# Altium schematic sheet GSMGPSMC60.SchDoc
size A2
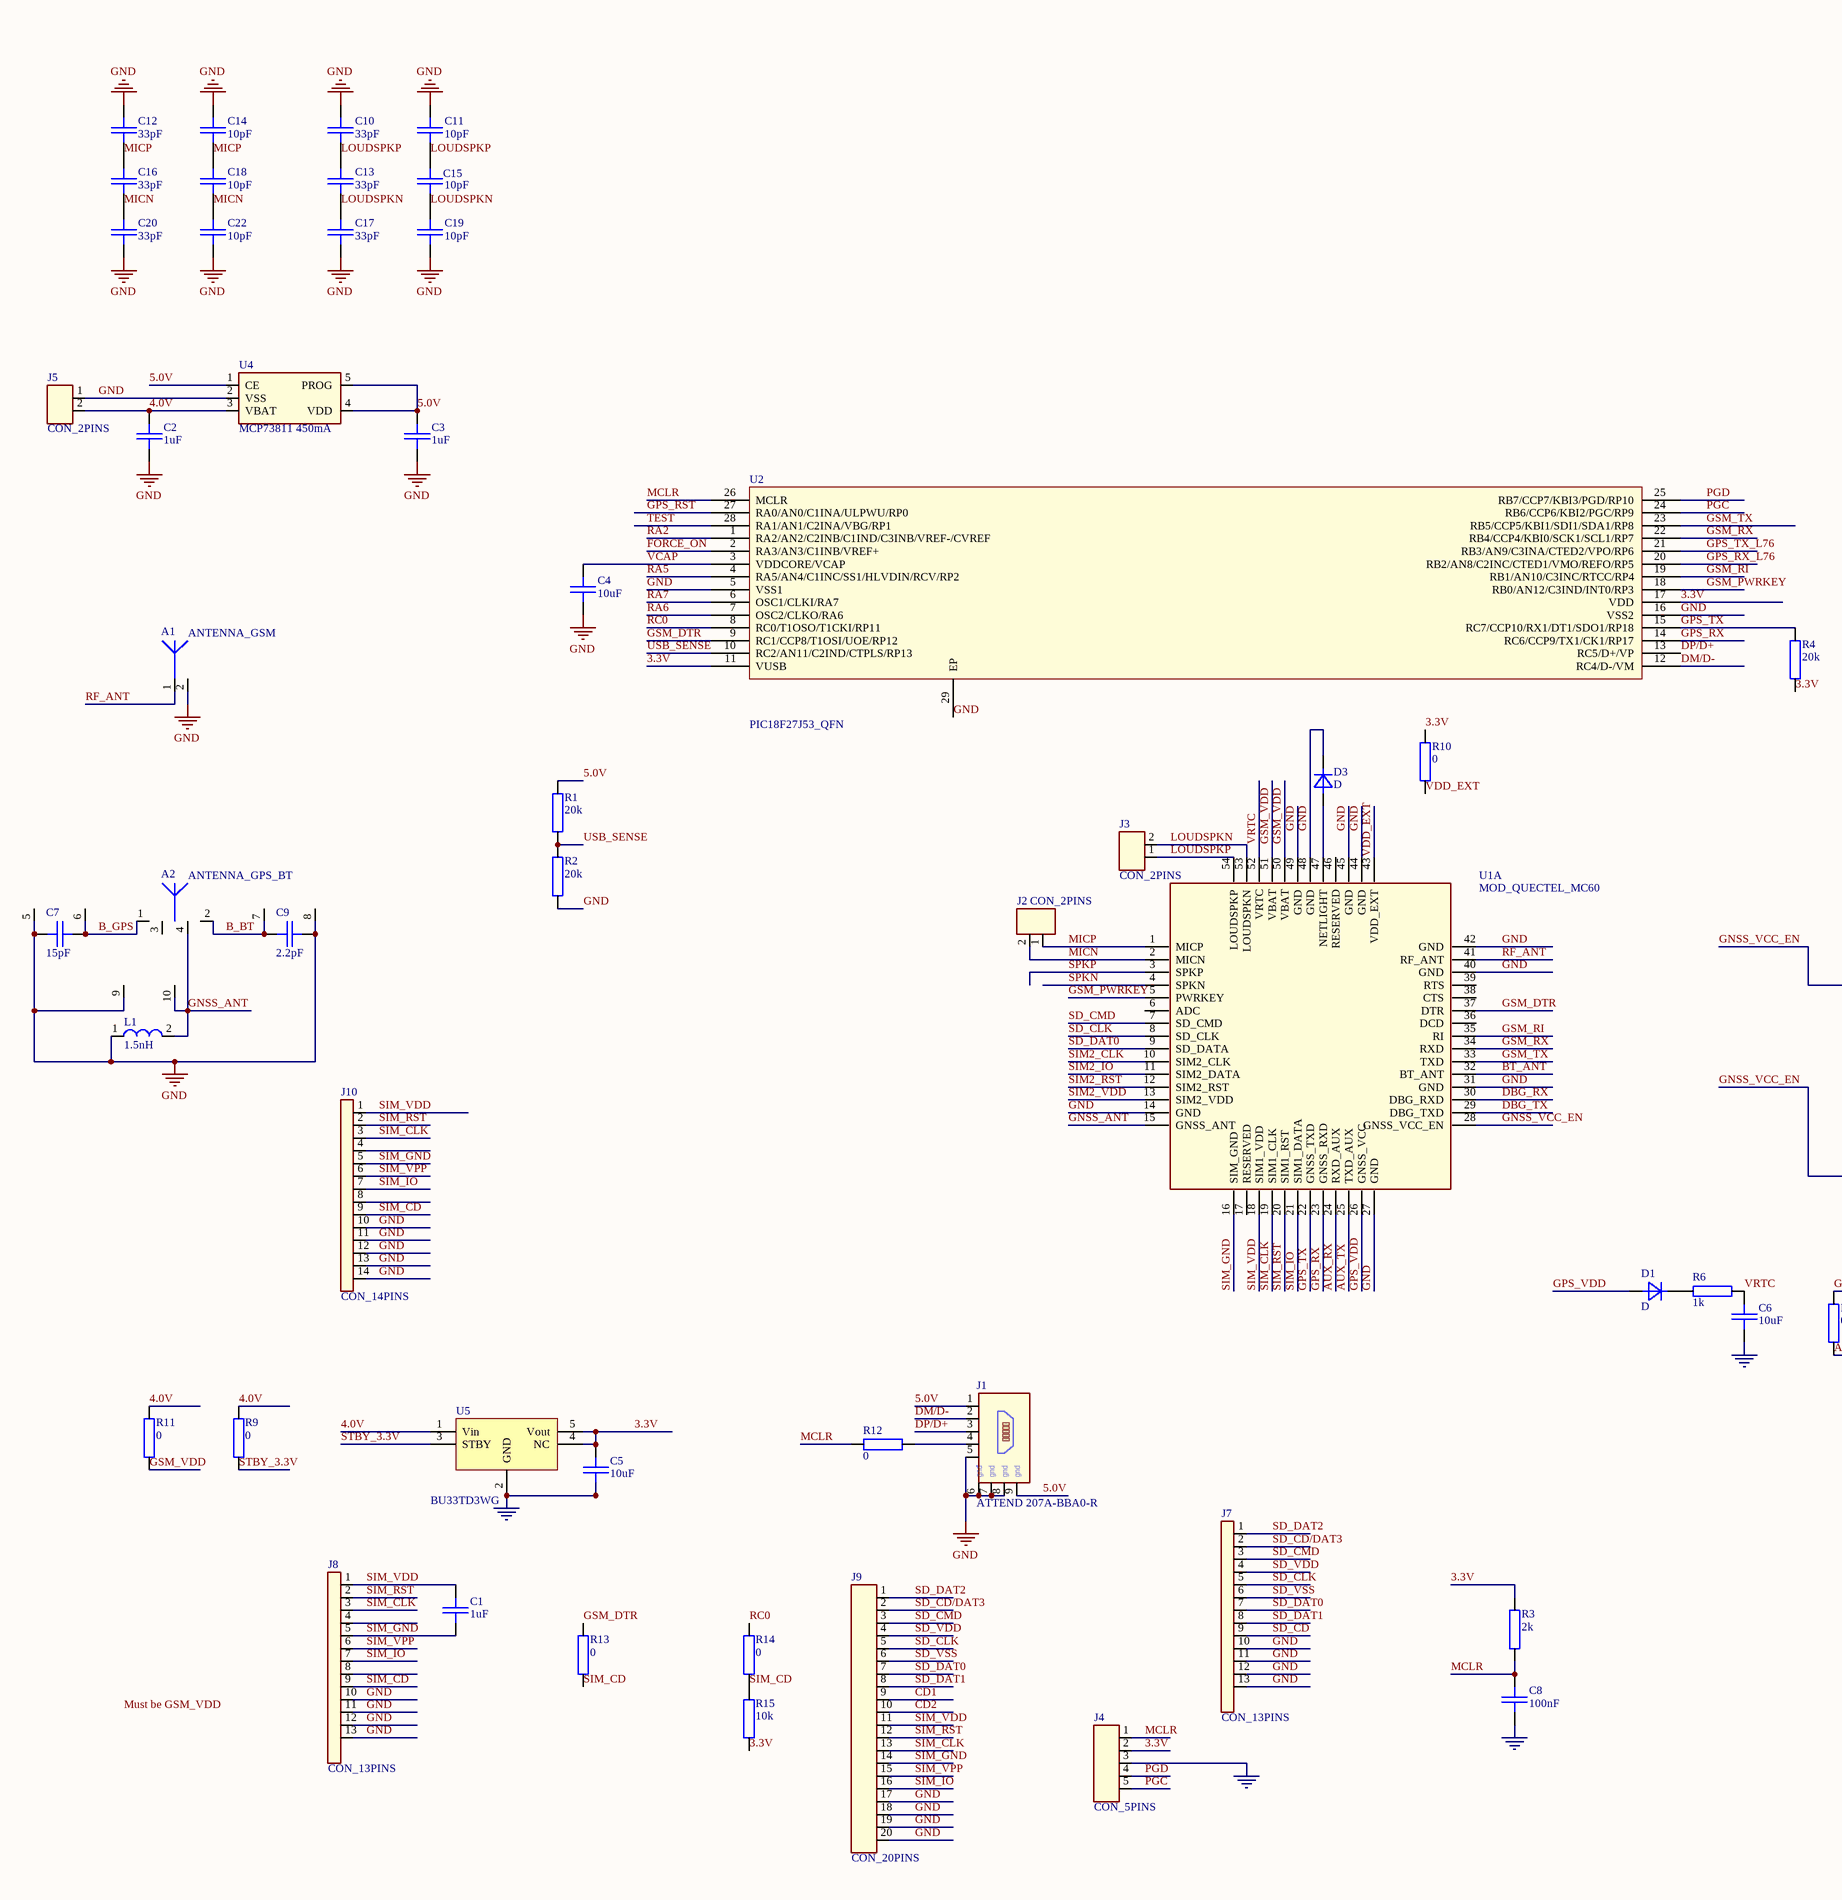
[diagram p0: GSMGPSMC60.SchDoc, left]
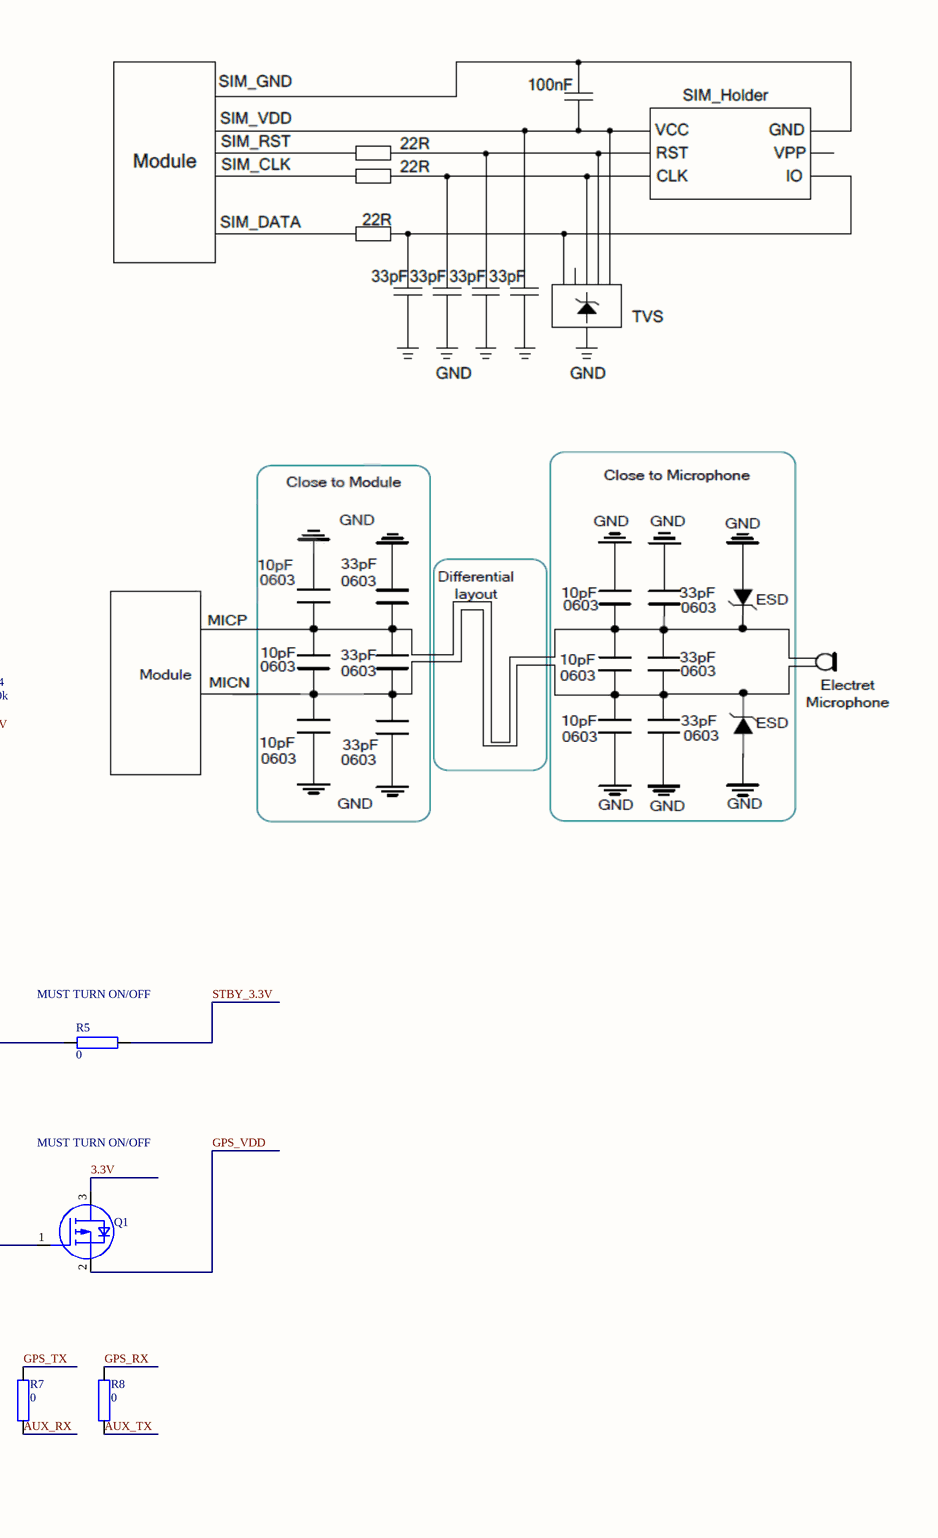
[diagram p1: GSMGPSMC60.SchDoc, right]

## Parts
A1  ANTENNA_GSM  [SMD_CON_ANTENNA_GSM]
A2  ANTENNA_GPS_BT  [SMD_CHIP_ANTENNA_GPS_BT - FLIP]
C1  1uF  [SMD_0603_CAPC1608X95N]
C2  1uF  [SMD_0603_CAPC1608X95N]
C3  1uF  [SMD_0603_CAPC1608X95N]
C4  10uF  [SMD_0603_CAPC1608X95N]
C5  10uF  [SMD_0603_CAPC1608X95N]
C6  10uF  [SMD_0603_CAPC1608X95N]
C7  15pF  [SMD_0402_CAPC1005X90N - ANTENNA]
C8  100nF  [SMD_0402_CAPC1005X90N]
C9  2.2pF  [SMD_0201_CAPC0603X33N - ANTENNA]
C10  33pF  [SMD_0402_CAPC1005X90N]
C11  10pF  [SMD_0402_CAPC1005X90N]
C12  33pF  [SMD_0402_CAPC1005X90N]
C13  33pF  [SMD_0402_CAPC1005X90N]
C14  10pF  [SMD_0402_CAPC1005X90N]
C15  10pF  [SMD_0402_CAPC1005X90N]
C16  33pF  [SMD_0402_CAPC1005X90N]
C17  33pF  [SMD_0402_CAPC1005X90N]
C18  10pF  [SMD_0402_CAPC1005X90N]
C19  10pF  [SMD_0402_CAPC1005X90N]
C20  33pF  [SMD_0402_CAPC1005X90N]
C22  10pF  [SMD_0402_CAPC1005X90N]
D1  D  [SMD_SOD523_SOD1608X65N]
D3  D  [SMD_LED_LAA67F]
J1  ATTEND 207A-BBA0-R  [SMD_CON_MICRO_USB]
J2  CON_2PINS  [PTH_MIC_6MM_2.7MM_PITCH1.9]
J3  CON_2PINS  [PTH_MIC_6MM_2.7MM_PITCH1.9]
J4  CON_5PINS  [SIP5 - PGM]
J5  CON_2PINS  [PTH_HDRV02W64P254_1X02]
J7  CON_13PINS  [NONE]
J8  CON_13PINS  [SMD_CON-ATTEND_MICRO_SIM_115Q-BCA0]
J9  CON_20PINS  [NONE]
J10  CON_14PINS  [NONE]
L1  1.5nH  [SMD_0402_INDC1005X55N - ANTENNA]
Q1  BSH202  [SMD_SOT23_SOT95P240X120-3N]  (value not drawn)
R1  20k  [SMD_0402_RESC1005X37N]
R2  20k  [SMD_0402_RESC1005X37N]
R3  2k  [SMD_0402_RESC1005X37N]
R4  20k  [SMD_0402_RESC1005X37N]
R5  0  [SMD_0402_RESC1005X37N]
R6  1k  [SMD_0603_RESC1608X55N]
R7  0  [SMD_0603_RESC1608X55N]
R8  0  [SMD_0603_RESC1608X55N]
R9  0  [SMD_0402_RESC1005X37N]
R10  0  [SMD_0402_RESC1005X37N]
R11  0  [SMD_0402_RESC1005X37N]
R12  0  [SMD_0402_RESC1005X37N]
R13  0  [SMD_0402_RESC1005X37N]
R14  0  [SMD_0402_RESC1005X37N]
R15  10k  [SMD_0402_RESC1005X37N]
U1  MOD_QUECTEL_MC60  [SMD_MOD_MC60]  (part A of 2)
U2  PIC18F27J53_QFN  [SMD_QFN65P600X600X100-29AN]
U4  MCP73811 450mA  [SMD_SOT26_SOT95P285X140-5N - DLV]
U5  BU33TD3WG  [SMD_SOT26_SOT95P285X140-5N - DLV]

## Nets
GND: A1.2 A2.5 A2.8 A2.9 C2.2 C3.2 C4.2 C5.2 C6.2 C7.1 C8.2 C9.2 C10.1 C11.1 C12.1 C14.1 C17.2 C19.2 C20.2 C22.2 D3.1(C) J1.5 J1.6 J1.7 J1.8 J4.3 J5.1 J7.10 J7.11 J7.12 J7.13 J8.10 J8.11 J8.12 J8.13 J9.17 J9.18 J9.19 J9.20 J10.10 J10.11 J10.12 J10.13 J10.14 L1.1 R2.1 U1.14(GND) U1.27(GND) U1.31(GND) U1.40(GND) U1.42(GND) U1.44(GND) U1.45(GND) U1.48(GND) U1.49(GND) U2.5(VSS1) U2.16(VSS2) U2.29(EP) U4.2(VSS) U5.2(GND)
3.3V: C5.1 J4.2 Q1.3(D) R3.1 R4.1 R10.2 R15.2 U2.11(VUSB) U2.17(VDD) U5.4(NC) U5.5(Vout)
4.0V: C2.1 J5.2 R9.1 R11.1 U4.3(VBAT) U5.1(Vin)
5.0V: C3.1 J1.1 J1.9 R1.2 U4.1(CE) U4.4(VDD) U4.5(PROG)
AUX_RX: R7.2 U1.24(RXD_AUX)
AUX_TX: R8.1 U1.25(TXD_AUX)
B_BT: A2.2 A2.7 C9.1
B_GPS: A2.1 A2.6 C7.2
BT_ANT: U1.32(BT_ANT)
CD1: J9.9
CD2: J9.10
DBG_RX: U1.30(DBG_RXD)
DBG_TX: U1.29(DBG_TXD)
DM/D-: J1.2 U2.12(RC4/D-/VM)
DP/D+: J1.3 U2.13(RC5/D+/VP)
FORCE_ON: U2.2(RA3/AN3/C1INB/VREF+)
GNSS_ANT: A2.4 A2.10 L1.2 U1.15(GNSS_ANT)
GNSS_VCC_EN: Q1.1(G) R5.1 U1.28(GNSS_VCC_EN)
GPS_RST: U2.27(RA0/AN0/C1INA/ULPWU/RP0)
GPS_RX: R8.2 U1.23(GNSS_RXD) U2.14(RC6/CCP9/TX1/CK1/RP17)
GPS_RX_L76: U2.20(RB2/AN8/C2INC/CTED1/VMO/REFO/RP5)
GPS_TX: R4.2 R7.1 U1.22(GNSS_TXD) U2.15(RC7/CCP10/RX1/DT1/SDO1/RP18)
GPS_TX_L76: U2.21(RB3/AN9/C3INA/CTED2/VPO/RP6)
GPS_VDD: D1.2(A) Q1.2(S) U1.26(GNSS_VCC)
GSM_DTR: R13.1 U1.37(DTR) U2.9(RC1/CCP8/T1OSI/UOE/RP12)
GSM_PWRKEY: U1.5(PWRKEY) U2.18(RB0/AN12/C3IND/INT0/RP3)
GSM_RI: U1.35(RI) U2.19(RB1/AN10/C3INC/RTCC/RP4)
GSM_RX: U1.34(RXD) U2.22(RB4/CCP4/KBI0/SCK1/SCL1/RP7)
GSM_TX: U1.33(TXD) U2.23(RB5/CCP5/KBI1/SDI1/SDA1/RP8)
GSM_VDD: R11.2 U1.50(VBAT) U1.51(VBAT)
LOUDSPKN: C13.2 C15.2 C17.1 C19.1 J3.2 U1.53(LOUDSPKN)
LOUDSPKP: C10.2 C11.2 C13.1 C15.1 J3.1 U1.54(LOUDSPKP)
MCLR: C8.1 J4.1 R3.2 R12.2 U2.26(MCLR)
MICN: C16.2 C18.2 C20.1 C22.1 J2.2 U1.2(MICN)
MICP: C12.2 C14.2 C16.1 C18.1 J2.1 U1.1(MICP)
PGC: J4.5 U2.24(RB6/CCP6/KBI2/PGC/RP9)
PGD: J4.4 U2.25(RB7/CCP7/KBI3/PGD/RP10)
RA2: U2.1(RA2/AN2/C2INB/C1IND/C3INB/VREF-/CVREF)
RA5: U2.4(RA5/AN4/C1INC/SS1/HLVDIN/RCV/RP2)
RA6: U2.7(OSC2/CLKO/RA6)
RA7: U2.6(OSC1/CLKI/RA7)
RC0: R14.1 U2.8(RC0/T1OSO/T1CKI/RP11)
RF_ANT: A1.1 U1.41(RF_ANT)
SD_CD: J7.9
SD_CD/DAT3: J7.2 J9.2
SD_CLK: J7.5 J9.5 U1.8(SD_CLK)
SD_CMD: J7.3 J9.3 U1.7(SD_CMD)
SD_DAT0: J7.7 J9.7 U1.9(SD_DATA)
SD_DAT1: J7.8 J9.8
SD_DAT2: J7.1 J9.1
SD_VDD: J7.4 J9.4
SD_VSS: J7.6 J9.6
SIM2_CLK: U1.10(SIM2_CLK)
SIM2_IO: U1.11(SIM2_DATA)
SIM2_RST: U1.12(SIM2_RST)
SIM2_VDD: U1.13(SIM2_VDD)
SIM_CD: J8.9 J10.9 R13.2 R14.2 R15.1
SIM_CLK: J8.3 J9.13 J10.3 U1.19(SIM1_CLK)
SIM_GND: C1.2 J8.5 J9.14 J10.5 U1.16(SIM_GND)
SIM_IO: J8.7 J9.16 J10.7 U1.21(SIM1_DATA)
SIM_RST: J8.2 J9.12 J10.2 U1.20(SIM1_RST)
SIM_VDD: C1.1 J8.1 J9.11 J10.1 U1.18(SIM1_VDD)
SIM_VPP: J8.6 J9.15 J10.6
SPKN: U1.4(SPKN)
SPKP: U1.3(SPKP)
STBY_3.3V: R5.2 R9.2 U5.3(STBY)
TEST: U2.28(RA1/AN1/C2INA/VBG/RP1)
USB_SENSE: R1.1 R2.2 U2.10(RC2/AN11/C2IND/CTPLS/RP13)
VCAP: C4.1 U2.3(VDDCORE/VCAP)
VDD_EXT: R10.1 U1.43(VDD_EXT)
VRTC: C6.1 R6.1 U1.52(VRTC)
NetD1_1: D1.1(C) R6.2
NetD3_2: D3.2(A) U1.47(NETLIGHT)
NetJ1_4: J1.4 R12.1

Not connected (* = marked no-connect by the designer): A2 3; J8 4 8; J10 4 8; U1 6(ADC) 17(RESERVED) 36(DCD) 38(CTS) 39(RTS) 46(RESERVED)

## Notes on the sheet
- (near R5) MUST TURN ON/OFF
- MUST TURN ON/OFF
- Labels drawn without touching a wire or pin: Must be GSM_VDD
- (in symbol CON_USB_MINI) gnd

## Library data of the parts
A1 = ANTENNA_2: NOTE: <NOTE>
A2 = ANTENNA_GPS_BT: NOTE: <NOTE>
C1-C20 C22 = C: NOTE: <NOTE>
D1 D3 = D: NOTE: <NOTE>
J1 = CON_USB_MINI: NOTE: <NOTE>
J2 J3 J5 = CON_2PINS: NOTE: <NOTE>
J4 = CON_5PINS: NOTE: <NOTE>
L1 = L
Q1 = TRA000000687: DB_PART_TYPE: MOSFET\P_Channel; DB_MANUFACTURER_PART: NXP        BSH202; NOTE: <NOTE>; DB_T_RANGE: -55 to 150; DB_VOLTAGE: 30V; DB_CURRENT: 0.52A; DB_PACKAGE: SOT23; DB_DESCRIPTION: TRANS BSH202 SOT23; DB_PCB_DEVICE: SMD_SOT23_SOT95P230X110-3N; DB_APPROVED_ON: 09.10.2010 г.; DB_STATUS: NEW; DB_PART_NUMBER: TRA000000687; DB_VALUE: BSH202; DB_DATASHEET: http://john.epiqdesign.com/projects/CIS_Datasheets/BSH202_NXP.pdf?rev=337&sc=0
R1-R15 = R: NOTE: <NOTE>; R_BDS: R
U2 = IC_PIC18F27J53_QFN
U4 = IC_MCP73812: MCP73812; DB_PART_NUMBER: PSU000000127; DB_PART_TYPE: Linear Voltage Regulator; DB_MANUFACTURER_PART: ROHM        BD33KA5WF-E2; DB_T_RANGE: -40 to 105; DB_VOLTAGE: 3.3V; DB_CURRENT: 500mA; DB_PACKAGE: SOIC-8; DB_DESCRIPTION: IC BD33KA5WF-E2 SOIC-8; DB_PCB_DEVICE: SMD_SOIC127P620X160-8N; DB_CERTIFIED: ISHIDDEN=T; DB_APPROVED_BY: VSN; DB_APPROVED_ON: 07.5.2014 г. 13:18:28; DB_STATUS: NEW; DB_DATASHEET: http://john.epiqdesign.com/projects/CIS_Datasheets/IC_bdxxka5wf-e-209388.pdf?rev=1408&sc=0
U5 = IC_BU33TD3WG
U1 = MOD_QUECTEL_MC60: PCB DECAL: *